# Altium schematic sheet 8-Bluetooth.SchDoc
size A4
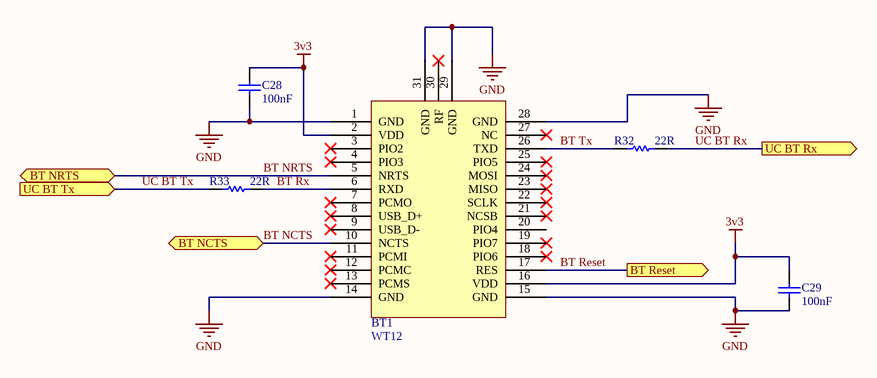
[diagram p0: 8-Bluetooth.SchDoc]

## Parts
BT1  WT12  [WT12]
C28  value 100nF  [1608[0603]]  (hidden comment: Cap)
C29  value 100nF  [1608[0603]]  (hidden comment: Cap)
R32  value 22R  [1608[0603]]  (hidden comment: Res1)
R33  value 22R  [1608[0603]]  (hidden comment: Res1)

## Ports
BT NCTS (bidir), BT NRTS (bidir), BT Reset (out), UC BT Rx (out), UC BT Tx (in)

## Nets
3v3: BT1.2(VDD) BT1.16(VDD) C28.2 C29.2
GND: BT1.1(GND) BT1.14(GND) BT1.15(GND) BT1.28(GND) BT1.29(GND) BT1.31(GND) C28.1 C29.1
BT NCTS: BT1.10(NCTS) ; port BT NCTS
BT NRTS: BT1.5(NRTS) ; port BT NRTS
BT Reset: BT1.17(RES) ; port BT Reset
BT Rx: BT1.6(RXD) R33.2
BT Tx: BT1.26(TXD) R32.1
UC BT Rx: R32.2 ; port UC BT Rx
UC BT Tx: R33.1 ; port UC BT Tx

Not connected (* = marked no-connect by the designer): BT1 3(PIO2)* 4(PIO3)* 7(PCMO)* 8(USB_D+)* 9(USB_D-)* 11(PCMI)* 12(PCMC)* 13(PCMS)* 18(PIO6)* 19(PIO7)* 20(PIO4) 21(NCSB)* 22(SCLK)* 23(MISO)* 24(MOSI)* 25(PIO5)* 27(NC)* 30(RF)*

## Library data of the parts
C28 C29 = Cap: Capacitor; Manufacturer: Yageo; Manufacturer Part Number: CC0603KRX7R9BB104; Capacitance: 0.10µF; Tolerance: ±10%; Voltage - Rated: 50V; Temperature Coefficient: X7R; Supplier 1: Digi-Key; Supplier Part Number 1: 311-1344-1-ND; RoHS: RoHS Compliant; Category: Capacitors; Stock 1: 4016262; Pricing 1: 1=0.15, 10=0.043, 25=0.0312, 50=0.0232, 100=0.0189, 250=0.0158, 500=0.01346, 1000=0.01059 (CAD); Packaging: Cut Tape (CT); Part Status: Active; Operating Temperature: -55°C ~ 125°C; Features: -; Ratings: -; Applications: General Purpose; Failure Rate: -; Mounting Type: Surface Mount, MLCC; Package / Case: 0603 (1608 Metric); Size / Dimension: 0.063" L x 0.031" W (1.60mm x 0.80mm); Height - Seated (Max): -; Thickness (Max): 0.035" (0.90mm); Lead Spacing: -; Lead Style: -; ComponentLink1URL: http://www.yageo.com/documents/recent/UPY-GPHC_X7R_6.3V-to-50V_16.pdf; ComponentLink1Description: http://www.yageo.com/documents/recent/UPY-GPHC_X7R_6.3V-to-50V_16.pdf
R32 R33 = Res1: Resistor; Manufacturer: Yageo; Manufacturer Part Number: RC0603JR-0722RL; Resistance (Ohms): 22; Tolerance: ±5%; Power (Watts): 0.1W, 1/10W; Temperature Coefficient: ±100ppm/°C; Supplier 1: Digi-Key; Supplier Part Number 1: 311-22GRCT-ND; RoHS: RoHS Compliant; Category: Resistors; Stock 1: 603781; Pricing 1: 1=0.16, 10=0.016, 25=0.0112, 50=0.0084, 100=0.0062, 250=0.0048, 500=0.00382, 1000=0.00281 (CAD); Packaging: Cut Tape (CT); Part Status: Active; Composition: Thick Film; Features: Moisture Resistant; Operating Temperature: -55°C ~ 155°C; Package / Case: 0603 (1608 Metric); Supplier Device Package: 0603; Size / Dimension: 0.063" L x 0.031" W (1.60mm x 0.80mm); Height - Seated (Max): 0.022" (0.55mm); Number of Terminations: 2; Failure Rate: -; ComponentLink1URL: http://www.yageo.com/NewPortal/yageodocoutput?fileName=/pdf/R-Chip/PYu-RC_Group_51_RoHS_L_4.pdf; ComponentLink1Description: http://www.yageo.com/NewPortal/yageodocoutput?fileName=/pdf/R-Chip/PYu-RC_Group_51_RoHS_L_4.pdf